# EAGLE design openSX70-dongle_v2-8 (EAGLE 8.6.1)
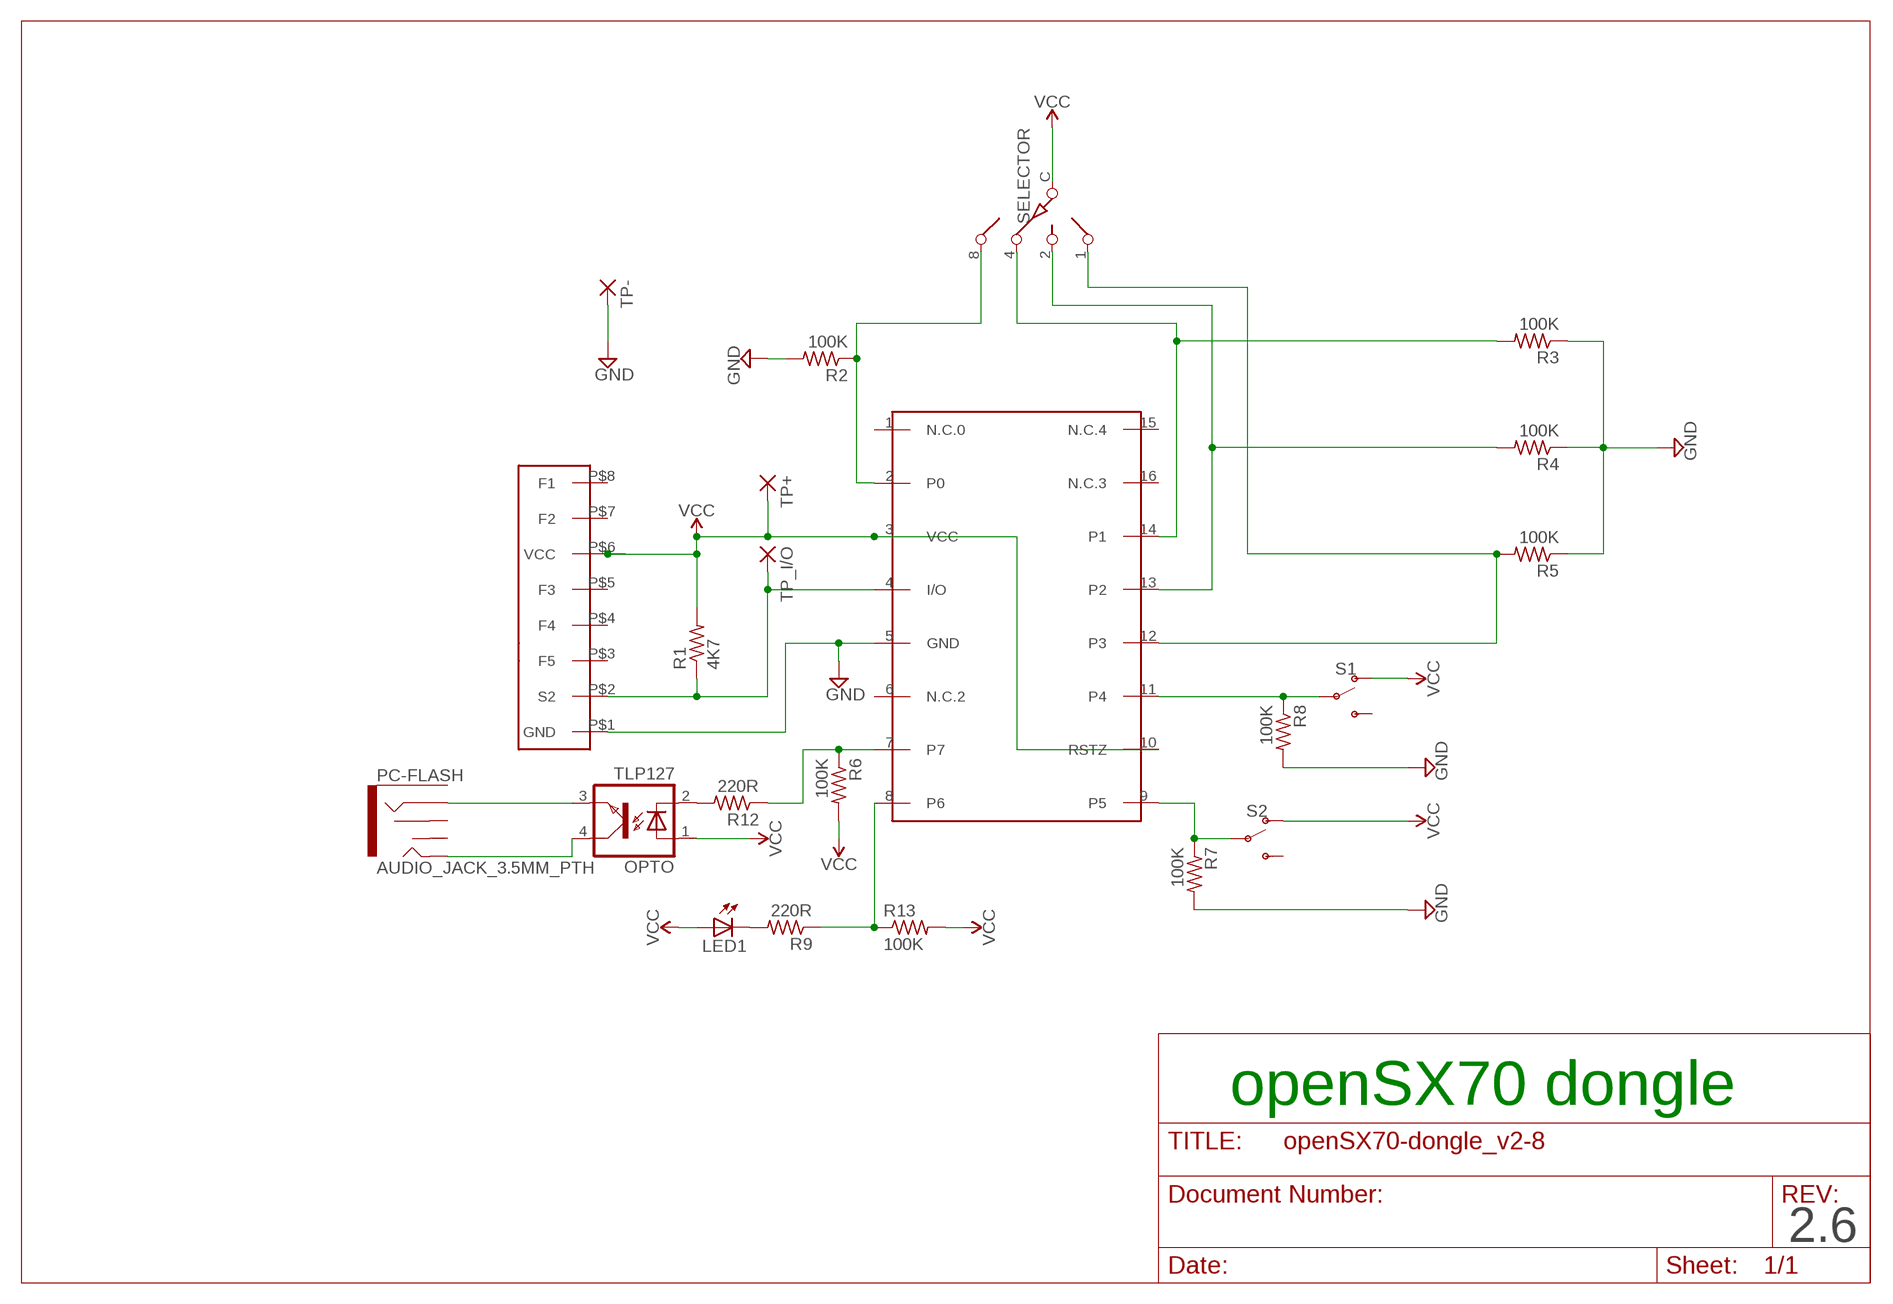
[diagram p0: schematic, sheet 1]

## Parts
DS2408  DS2408  [SO16]
LED1  LED3MM  [LED3MM]
OPTO  TLP127  [SO-4]
PC-FLASH  AUDIO_JACK_3.5MM_PTH  [AUDIO-JACK]
R1  4K7  R-US_M0805  [M0805]
R2  100K  R-US_M0805  [M0805]
R3  100K  R-US_M0805  [M0805]
R4  100K  R-US_M0805  [M0805]
R5  100K  R-US_M0805  [M0805]
R6  100K  R-US_M0805  [M0805]
R7  100K  R-US_M0805  [M0805]
R8  100K  R-US_M0805  [M0805]
R9  220R  R-US_M0805  [M0805]
R12  220R  R-US_M0805  [M0805]
R13  100K  R-US_M0805  [M0805]
S1  SWITCH-SPDT-SMD-RIGHT-ANGLE  [SWITCH_SPST_SMD_A]
S2  SWITCH-SPDT-SMD-RIGHT-ANGLE  [SWITCH_SPST_SMD_A]
SELECTOR  SW-C16  [SW-C16]
TP+  SMD2  [SMD1,27-2,54]
TP-  SMD2  [SMD1,27-2,54]
TP_I/O  SMD2  [SMD1,27-2,54]
U$1  FLASH-EDGE-CONNECTOR  [FLASH-EDGE-8]

## Nets
GND: DS2408.5(GND) R2.2 R3.1 R4.1 R5.1 R7.2 R8.2 TP-.1(P) U$1.P$1(GND)
N$1: DS2408.4(I/O) R1.1 TP_I/O.1(P) U$1.P$2(S2)
N$2: LED1.K(C) R9.2
N$3: DS2408.2(P0) R2.1 SELECTOR.8
N$4: DS2408.14(P1) R3.2 SELECTOR.4
N$5: DS2408.13(P2) R4.2 SELECTOR.2
N$6: DS2408.11(P4) R8.1 S1.2(P)
N$7: DS2408.9(P5) R7.1 S2.2(P)
N$8: DS2408.8(P6) R9.1 R13.1
N$10: OPTO.2(C) R12.2
N$11: DS2408.7 R6.1 R12.1
N$12: OPTO.4(COL) PC-FLASH.TIP
N$13: DS2408.12(P3) R5.2 SELECTOR.1
N$15: OPTO.3(EMIT) PC-FLASH.RING
VCC: DS2408.3(VCC) DS2408.10(RSTZ) LED1.A OPTO.1(A) R1.2 R6.2 R13.2 S1.1(O) S2.1(O) SELECTOR.C TP+.1(P) U$1.P$6(VCC)
Unconnected: DS2408.1(N.C.0) DS2408.6(N.C.2) DS2408.15(N.C.4) DS2408.16(N.C.3) PC-FLASH.RSH PC-FLASH.SLEEVE PC-FLASH.TSH S1.3(S) S2.3(S) U$1.P$3(F5) U$1.P$4(F4) U$1.P$5(F3) U$1.P$7(F2) U$1.P$8(F1)

## Notes on the sheet
- openSX70 dongle
- 2.6

## Library data of the parts
DS2408 = DS2408-joaco:DS2408
LED1 = adafruit:LED: LED OSRAM: - CHIPLED LG R971, LG N971, LY N971, LG Q971, LY Q971, LO R971, LY R971 LH N974, LH R974 LS Q976, LO Q976, LY Q976 LO Q996 - Hyper CHIPLED LW Q18S LB Q993, LB Q99A, LB R99A - SideLED LS A670, LO A670, LY A670, LG A670, LP A670 LB A673, LV A673, LT A673, LW A673 LH A674 LY A675 LS A676, LA A676, LO A676, LY A676, LW A676 LS A679, LY A679, LG A679 - Hyper Micro SIDELED® LS Y876, LA Y876, LO Y876, LY Y876 LT Y87S - SmartLED LW L88C, LW L88S LB L89C, LB L89S, LG L890 LS L89K, LO L89K, LY L89K LS L896, LA L896, LO L896, LY L896 - TOPLED LS T670, LO T670, LY T670, LG T670, LP T670 LSG T670, LSP T670, LSY T670, LOP T670, LYG T670 LG T671, LOG T671, LSG T671 LB T673, LV T673, LT T673, LW T673 LH T674 LS T676, LA T676, LO T676, LY T676, LB T676, LH T676, LSB T676, LW T676 LB T67C, LV T67C, LT T67C, LS T67K, LO T67K, LY T67K, LW E67C LS E67B, LA E67B, LO E67B, LY E67B, LB E67C, LV E67C, LT E67C LW T67C LS T679, LY T679, LG T679 LS T770, LO T770, LY T770, LG T770, LP T770 LB T773, LV T773, LT T773, LW T773 LH T774 LS E675, LA E675, LY E675, LS T675 LS T776, LA T776, LO T776, LY T776, LB T776 LHGB T686 LT T68C, LB T68C - Hyper Mini TOPLED® LB M676 - Mini TOPLED Santana® LG M470 LS M47K, LO M47K, LY M47K Source: http://www.osram.convergy.de/
OPTO = openSX70:TLP127
PC-FLASH = SparkFun-Connectors:AUDIO_JACK_3.5MM: Audio Jack 3.5mm variants of PTH and SMT stereo audio jack with bypass switches. SparkFun Products: SparkFun SparkPunk Sound Kit <[https://www.sparkfun.com/products/11177]> - PTH MP3 Trigger <https://www.sparkfun.com/products/13720> -3.5mm SMD SparkFun PicoBoard <https://www.sparkfun.com/products/11888>- 2.5mm SMD; PROD_ID: CONN-08774; SF_ID: PRT-08032
R1-R9 R12 R13 = rcl:R-US_: RESISTOR, American symbol
S1 S2 = SparkFun-Switches:SWITCH-SPDT: Single Pole, Double Throw (SPDT) Switch Single-pole, double-throw (SPDT) switch. Variant Overview SMD-AYZ0202 Surface Mount DPDT Switch <https://www.sparkfun.com/products/597> (COM-00597) Used on e.g. LilyPad Arduino USB - ATmega32U4 Board <https://www.sparkfun.com/products/12049> PTH-11.6X4.0MM SPDT Mini Power Switch <https://www.sparkfun.com/products/102> (COM-00102) Used on e.g. SparkFun Simon Says - Through-Hole Soldering Kit <https://www.sparkfun.com/products/10547> (KIT-10547) PTH-11.6X4.0MM-KIT KIT version of SPDT Mini Power Switch - Simplifies soldering by removing tStop of switch pins - only one side can be soldered. PTH-11.6X4.0MM-LOCK LOCK version of SPDT Mini Power Switch - Offset pins hold switch in place for easier soldering. SMD-RIGHT-ANGLE Surface Mount Right Angle Switch <https://www.sparkfun.com/products/10860> (COM-10860) Used on e.g. SparkFun ESP8266 Thing <https://www.sparkfun.com/products/13231>; PROD_ID: SWCH-10651; SF_SKU: COM-10860
SELECTOR = special:SW-C16: SWITCH 16-step rotary switch
TP+ TP- TP_I/O = wirepad:SMD2: SMD PAD
U$1 = SX70-flash:FLASH-EDGE-CONNECTOR

## Board
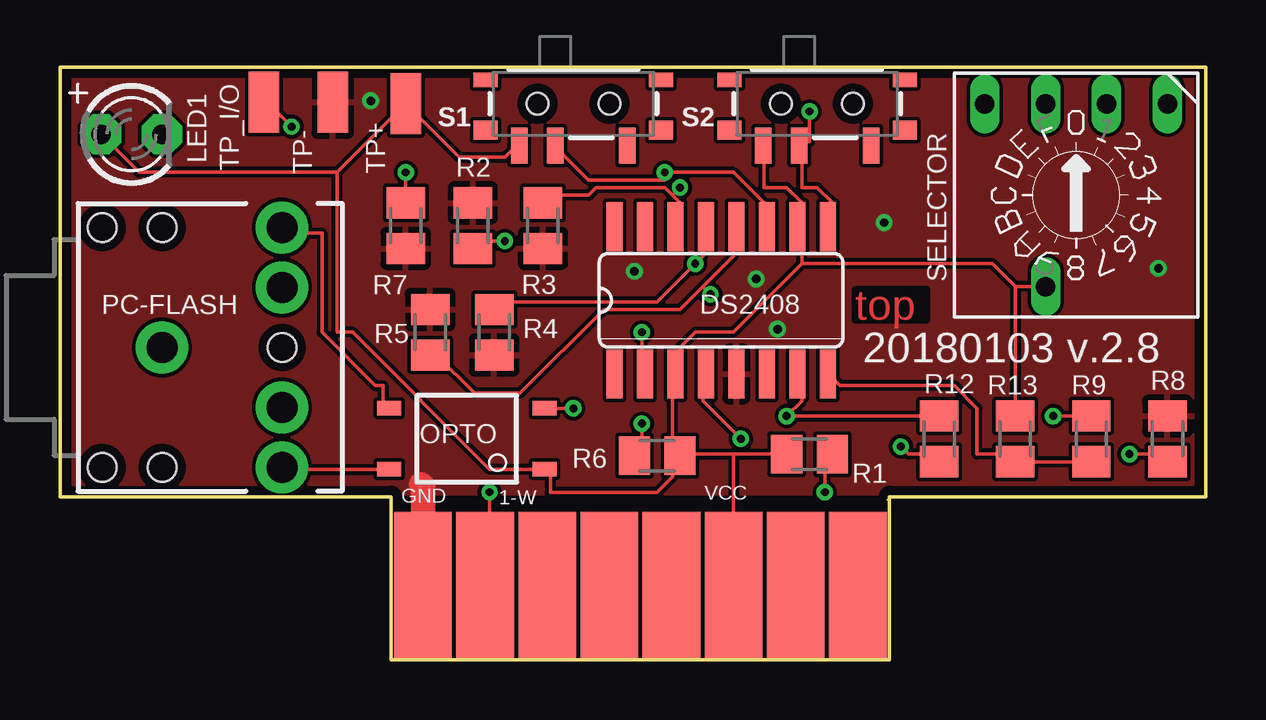
[diagram p1: board, top side]
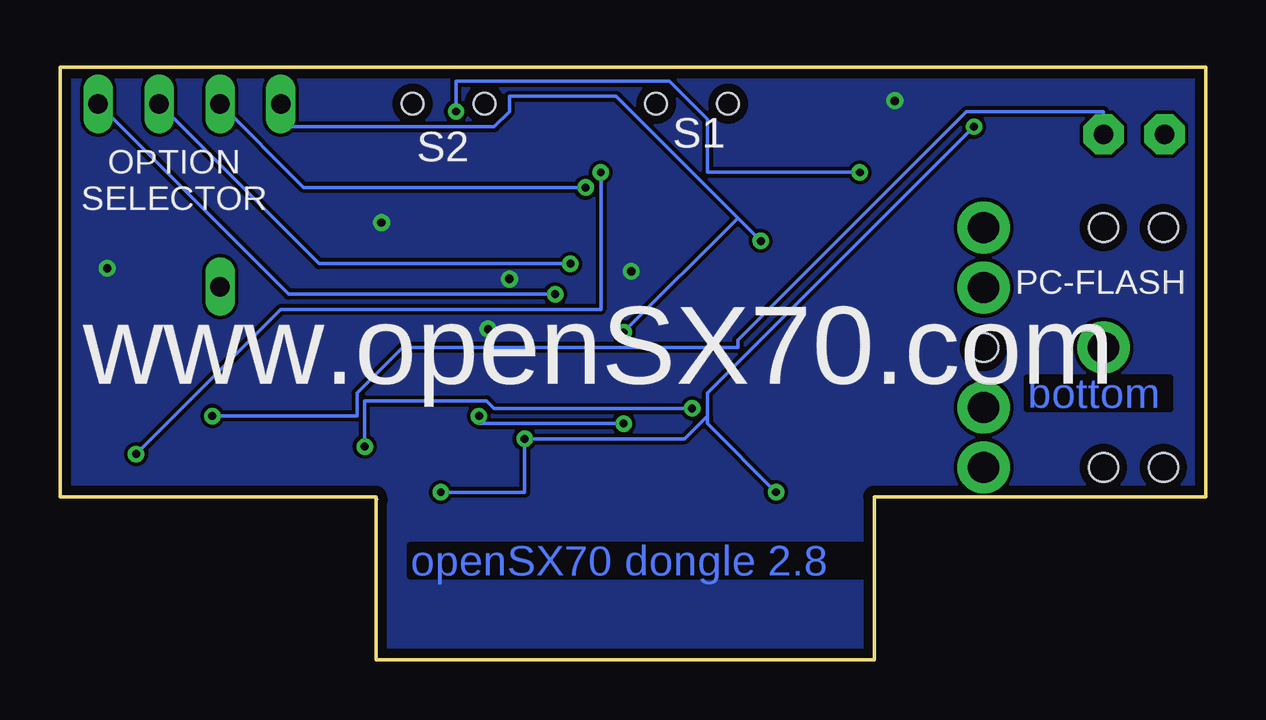
[diagram p2: board, bottom side, seen from below]

Size 47.75 x 24.71 mm. Coordinates in mm from the lower left corner, seen from the top.
Outline: 34.48,6.68 34.58,6.81
Outline: 34.58,6.81 34.58,0 13.8,0 13.8,6.81 0,6.81 0,24.71 47.75,24.71 47.75,6.81 34.58,6.81
Copper layers (1*16): Top 0.0356mm / dielectric 1.5011mm / Bottom 0.0356mm
Design rules "oshpark-2layer": minimum track width 6mil, minimum drill 13mil, track to track 6mil, track to pad 6mil, pad to pad 6mil, via to via 6mil, smd to smd 6mil, copper to edge 15mil, drill to drill 6mil, minimum pad ring 7mil, minimum via ring 7mil, stop-mask expansion 2.5mil, vias tented up to drill 0mil, thermal gap 10mil

### Footprints (pad centres in the part's own frame; a part is rotated, then mirrored left to right if it is on the bottom)
SO16 = smd 0.66 x 2.032: 1 -4.445,-3.073; 2 -3.175,-3.073; 3 -1.905,-3.073; 4 -0.635,-3.073; 5 0.635,-3.073; 6 1.905,-3.073; 7 3.175,-3.073; 8 4.445,-3.073; 9 4.445,3.073; 10 3.175,3.073; 11 1.905,3.073; 12 0.635,3.073; 13 -0.635,3.073; 14 -1.905,3.073; 15 -3.175,3.073; 16 -4.445,3.073
LED3MM = drill 0.813 pad 1.676 octagon: A -1.27,0; K 1.27,0
SO-4 = smd 1 x 0.6: 1 -3.24,0.635; 2 -3.24,-1.905; 3 3.24,-1.905; 4 3.24,0.635
AUDIO-JACK = drill 1.3 pad 2.184: RING 5,5; RSH 5,2.5; SLEEVE 0,0; TIP 5,-5; TSH 5,-2.5 | hole 1.2: 0,5; -2.5,5; -2.5,-5; 0,-5; 5,0
M0805 = smd 1.3 x 1.6: 1 -0.95,0; 2 0.95,0
SWITCH_SPST_SMD_A = smd 0.7 x 1.5: 1 -2.25,-1.75; 2 -0.75,-1.75; 3 2.25,-1.75 | smd 1 x 0.6: GND1 -3.65,1; GND3 3.65,1 | smd 1 x 0.8: GND2 -3.65,-1.1; GND4 3.65,-1.1 | hole 0.9: -1.5,0; 1.5,0
SW-C16 = drill 0.813 long: 1 -3.81,-3.81; 2 -1.27,-3.81; 4 1.27,-3.81; 8 3.81,-3.81; C 1.27,3.81
SMD1,27-2,54 = smd 1.27 x 2.54: 1 0,0
FLASH-EDGE-8 = smd 2.4 x 6.09: P$1 -9.065,0; P$2 -6.475,0; P$3 -3.885,0; P$4 -1.295,0; P$5 1.295,0; P$6 3.885,0; P$7 6.475,0; P$8 9.065,0

### Placement (x,y rotation side)
DS2408  27.56,15 0 top
LED1  2.98,21.92 0 top
OPTO  16.95,8.59 180 top
PC-FLASH  4.25,13.03 0 top
R1  31.24,8.59 180 top
R2  17.21,18.11 90 top
R3  20.13,18.11 90 top
R4  18.1,13.67 90 top
R5  15.43,13.67 270 top
R6  24.89,8.52 0 top
R7  14.41,18.11 270 top
R8  46.16,9.22 90 top
R9  42.99,9.22 90 top
R12  36.64,9.22 270 top
R13  39.81,9.22 90 top
S1  21.4,23.19 0 top
S2  31.56,23.19 0 top
SELECTOR  42.35,19.38 180 top
TP+  14.41,23.19 0 top
TP-  11.37,23.25 0 top
TP_I/O  8.51,23.25 0 top
U$1  24.19,3.12 0 top

### Tracks (layer width: path | path; a pad name or v marks a point on that pad's centre or on a via)
GND  (via drill 0.35)
  Top 1.016: U$1.P$1 15.13,7.24 15.05,7.32
  other vias: 23.94,16.21 29.02,15.89 29.91,13.79 12.95,23.32 34.35,18.24 45.78,16.33
  pour Bottom (isolate 0.152): -0.19,25.1 -0.19,6.68 13.78,6.68 13.78,0.01 34.73,0.01 34.73,6.68 48.07,6.68 48.07,25.1
  pour Top (isolate 0.152): -0.19,25.1 -0.19,6.68 13.78,6.68 13.84,6.93 34.8,6.93 34.73,6.68 48.07,6.68 48.07,25.1
N$1  (via drill 0.33)
  Top 0.152: v31.88,7 31.88,8.59 R1.1 | v28.38,9.22 26.8,10.81 26.8,11.76 DS2408.4 | v9.65,22.24 8.7,23.19 TP_I/O.1 | v17.91,7 17.91,3.19 U$1.P$2
  Bottom 0.152: v31.88,7 28.38,7 v28.38,9.22 21.72,9.22 20.76,10.17 | v9.65,22.24 20.76,11.13 20.76,10.17 | v17.91,7 20.76,9.86 20.76,10.17
N$2  (via drill 0.33)
  Top 0.152: v41.4,10.17 R9.2
  Bottom 0.152: v41.4,10.17 35.37,10.17 35.37,11.13 33.46,13.03 19.49,13.03 19.49,13.35 9.97,22.87 4.25,22.87 LED1.K
N$3  (via drill 0.33)
  Top 0.152: v18.54,17.48 17.27,17.48 R2.1 | v24.26,13.67 24.26,12.08 DS2408.2
  Bottom 0.152: 19.49,18.43 24.57,23.51 29.02,23.51 29.02,22.87 29.65,22.24 38.54,22.24 SELECTOR.8 | 19.49,18.43 v18.54,17.48 | 19.49,18.43 v24.26,13.67
N$4  (via drill 0.33)
  Top 0.152: 25.53,19.38 25.84,19.06 25.84,18.11 DS2408.14 | 25.53,19.38 25.21,19.7 22.35,19.7 22.03,19.38 20.45,19.38 R3.2 | 25.53,19.38 v25.84,19.7
  Bottom 0.152: SELECTOR.4 37.59,19.7 v25.84,19.7
N$5  (via drill 0.33)
  Top 0.152: R4.2 18.22,14.62 18.54,14.94 24.89,14.94 v26.48,16.52 26.8,16.84 26.8,17.79 DS2408.13
  Bottom 0.152: SELECTOR.2 36.96,16.52 v26.48,16.52
N$6  (via drill 0.33)
  Top 0.152: 25.53,20.33 25.21,20.02 22.03,20.02 20.76,21.29 S1.2 | 25.53,20.33 28.07,20.33 29.34,19.06 29.34,18.11 DS2408.11 | v44.58,8.59 46.16,8.59 R8.1 | 25.53,20.33 v25.21,20.33
  Bottom 0.152: v44.58,8.59 38.54,14.62 25.21,14.62 v25.21,20.33
N$7  (via drill 0.33)
  Top 0.152: DS2408.9 32.19,18.11 32.19,19.06 31.56,19.7 30.92,19.7 30.92,21.29 S2.2 30.92,21.6 31.24,21.6 v31.24,22.87 | v14.41,20.33 R7.1
  Bottom 0.152: v14.41,20.33 20.76,20.33 20.76,22.56 22.35,24.14 31.24,24.14 v31.24,22.87
N$8
  Top 0.152: R9.1 R13.1 39.81,8.59 38.23,8.59 38.23,10.49 37.27,11.44 32.51,11.44 32.19,11.76 DS2408.8
N$10  (via drill 0.33)
  Top 0.152: v21.4,10.49 OPTO.2 | v35.05,8.9 35.37,8.59 36.64,8.59 R12.2
  Bottom 0.152: v21.4,10.49 29.65,10.49 29.97,10.81 35.05,10.81 v35.05,8.9
N$11  (via drill 0.33)
  Top 0.152: v24.26,9.86 24.26,8.59 R6.1 | DS2408.7 30.92,11.76 30.92,10.81 v30.29,10.17 R12.1
  Bottom 0.152: v24.26,9.86 30.29,9.86 v30.29,10.17
N$12
  Top 0.152: OPTO.4 9.33,7.95 PC-FLASH.TIP
N$13  (via drill 0.33)
  Top 0.152: 26.8,15.57 28.07,16.84 28.07,17.79 DS2408.12 | 26.8,15.57 25.84,14.62 22.67,14.62 19.18,11.13 17.27,11.13 15.68,12.71 R5.2 | 26.8,15.57 v27.11,15.25
  Bottom 0.152: SELECTOR.1 38.23,15.25 v27.11,15.25
N$15
  Top 0.152: OPTO.3 13.46,10.49 13.46,11.44 13.14,11.44 10.92,13.67 10.92,17.79 9.33,17.79 PC-FLASH.RING
VCC
  Top 0.152: S2.1 29.34,21.29 29.34,19.7 30.29,19.7 30.92,19.06 30.92,18.11 DS2408.10 30.92,17.79 30.92,16.52 | 39.81,15.57 R13.2 | SELECTOR.C 39.81,15.57 | 30.92,16.52 38.86,16.52 39.81,15.57 | S1.1 18.86,21.29 18.54,20.97 16.64,20.97 TP+.1 11.56,20.33 | LED1.A 3.3,20.33 11.56,20.33 | R6.2 25.53,8.27 25.53,7.63 24.89,7 20.45,7 20.45,7.95 OPTO.1 17.91,7.95 12.19,13.67 11.56,13.67 11.56,20.33 | 28.07,8.59 25.84,8.59 R6.2 | 28.07,8.59 R1.2 | R6.2 25.53,8.59 25.53,11.76 DS2408.3 25.84,12.08 25.84,13.03 26.48,13.67 28.07,13.67 30.92,16.52 | 28.07,8.59 28.07,3.19 U$1.P$6

### Text on the board
Top: top
Bottom: bottom | openSX70 dongle 2.8
tPlace: 20180103 v.2.8
bPlace: www.openSX70.com
tNames: VCC | GND | 1-W
bNames: S1 | S2 | OPTION / SELECTOR | PC-FLASH